# EAGLE schematic rgbsaber_control_v1.6 (EAGLE 5.10)
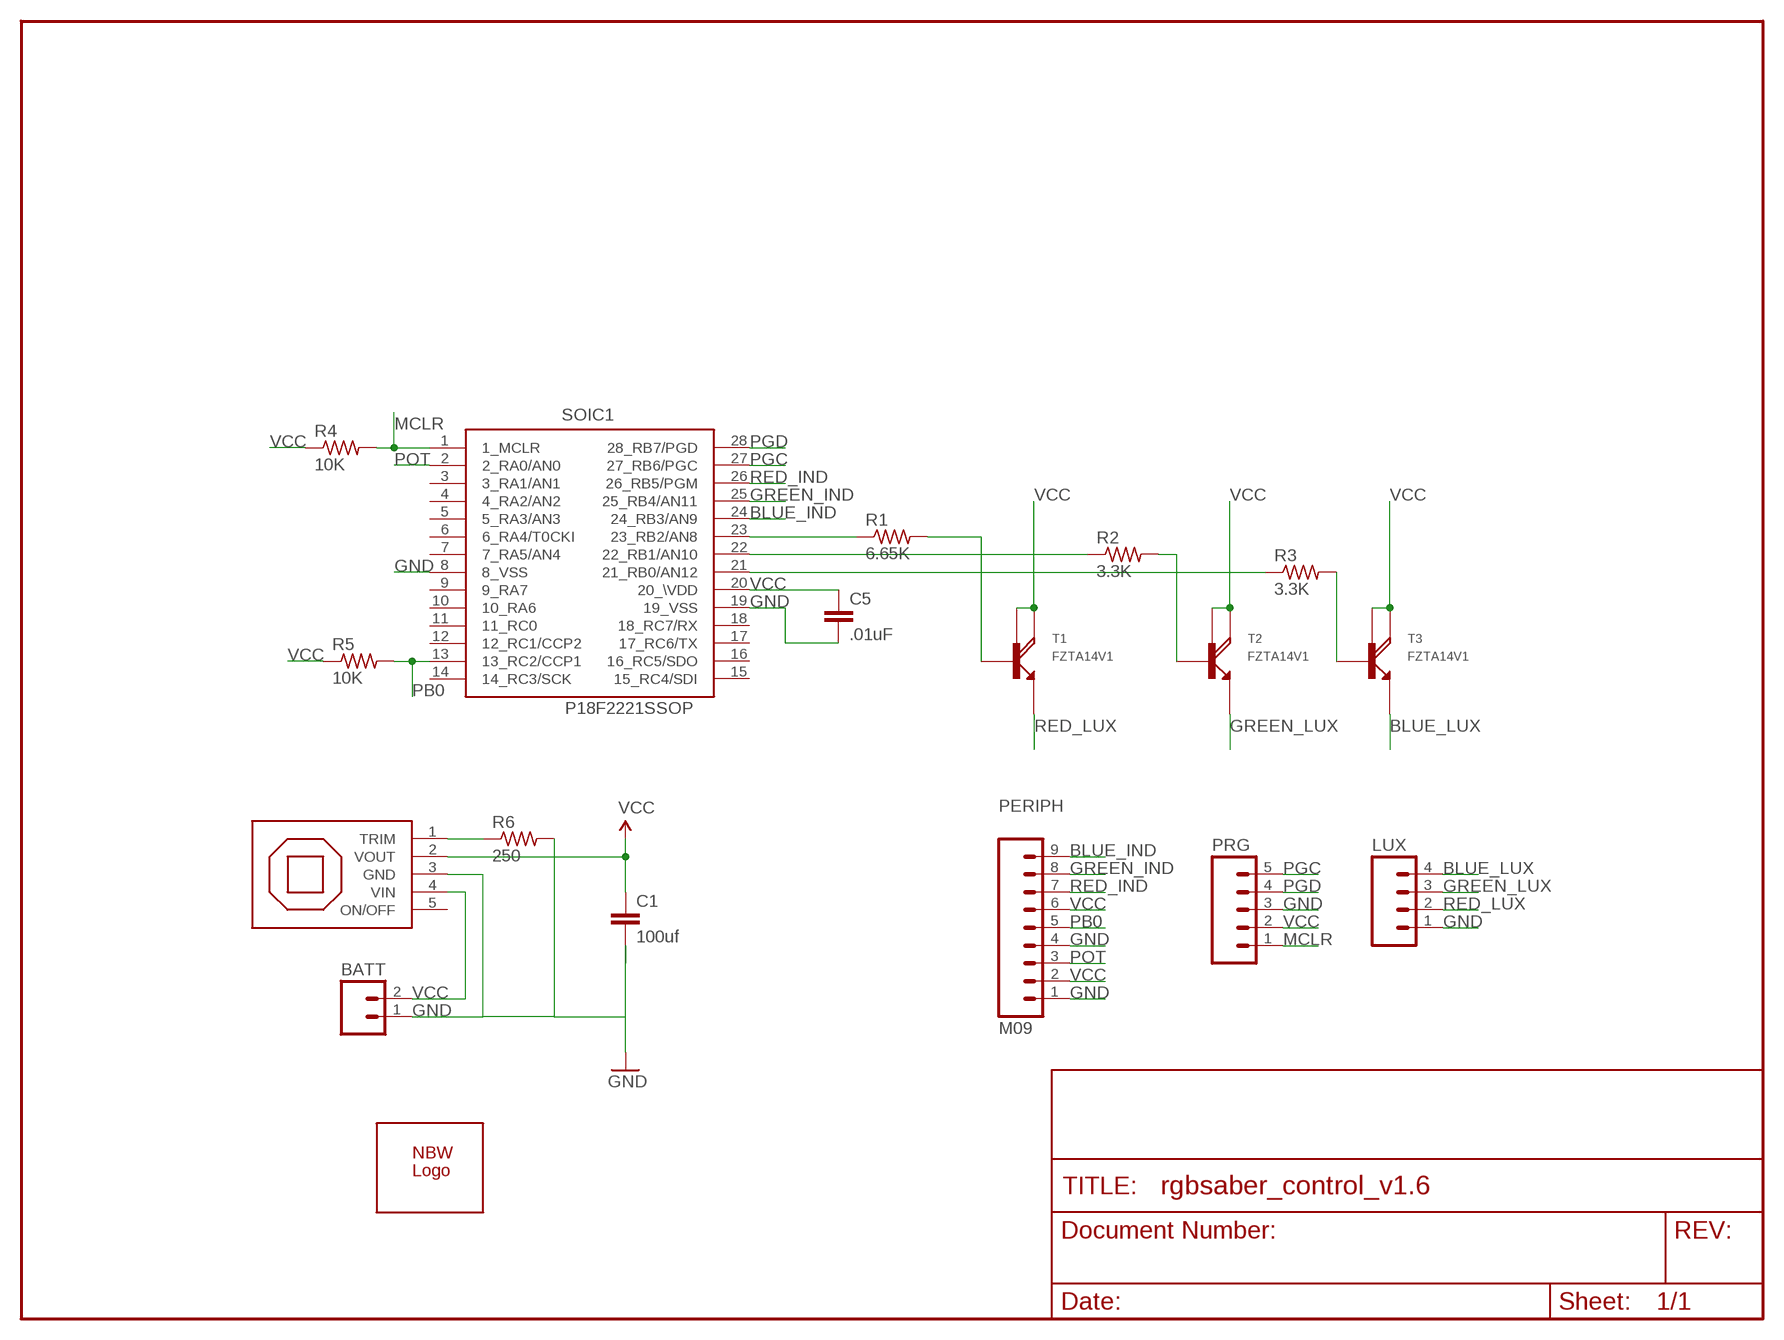
[diagram p0: schematic, sheet 1]

## Parts
BATT  M02PTH  [1X02]
C1  100uf  C5/7.2  [C5B7.2]
C5  .01uF  CAP0805  [0805]
LUX  M04PTH  [1X04]
PERIPH  M09  [1X09]
PRG  M05PTH  [1X05]
R1  6.65K  R-US_M0805  [M0805]
R2  3.3K  R-US_M0805  [M0805]
R3  3.3K  R-US_M0805  [M0805]
R4  10K  R-US_M0805  [M0805]
R5  10K  R-US_M0805  [M0805]
R6  250  R-US_M0805  [M0805]
REG  REG  OKR-T/3-W12  [1X05_2MM]
SOIC1  P18F2221SSOP  [SSOP-28]
T1  FZTA14V1  [SOT223]
T2  FZTA14V1  [SOT223]
T3  FZTA14V1  [SOT223]
U$5  NBW_LOGO  NBW_LOGOMED  [NBW_LOGO2]

## Nets
BLUE_IND: PERIPH.9 SOIC1.24(24_RB3/AN9)
BLUE_LUX: LUX.4 T3.EMIT(E)
GND: BATT.1 C1.2 C5.2 LUX.1 PERIPH.1 PERIPH.4 PRG.3 R6.2 REG.3(GND) SOIC1.8(8_VSS) SOIC1.19(19_VSS)
GREEN_IND: PERIPH.8 SOIC1.25(25_RB4/AN11)
GREEN_LUX: LUX.3 T2.EMIT(E)
MCLR: PRG.1 R4.2 SOIC1.1(1_MCLR)
N$1: R6.1 REG.1(TRIM)
N$4: R1.1 SOIC1.23(23_RB2/AN8)
N$5: R1.2 T1.BASE(B)
N$6: R2.1 SOIC1.22(22_RB1/AN10)
N$7: R2.2 T2.BASE(B)
N$8: R3.1 SOIC1.21(21_RB0/AN12)
N$9: R3.2 T3.BASE(B)
PB0: PERIPH.5 R5.2 SOIC1.13(13_RC2/CCP1)
PGC: PRG.5 SOIC1.27(27_RB6/PGC)
PGD: PRG.4 SOIC1.28(28_RB7/PGD)
POT: PERIPH.3 SOIC1.2(2_RA0/AN0)
PWR: BATT.2 REG.4(VIN)
RED_IND: PERIPH.7 SOIC1.26(26_RB5/PGM)
RED_LUX: LUX.2 T1.EMIT(E)
VCC: C1.1 C5.1 PERIPH.2 PERIPH.6 PRG.2 R4.1 R5.1 REG.2(VOUT) SOIC1.20(20_\VDD) T1.COLL(C) T1.HEAT(C2) T2.COLL(C) T2.HEAT(C2) T3.COLL(C) T3.HEAT(C2)
Unconnected: REG.5(ON/OFF) SOIC1.3(3_RA1/AN1) SOIC1.4(4_RA2/AN2) SOIC1.5(5_RA3/AN3) SOIC1.6(6_RA4/T0CKI) SOIC1.7(7_RA5/AN4) SOIC1.9(9_RA7) SOIC1.10(10_RA6) SOIC1.11(11_RC0) SOIC1.12(12_RC1/CCP2) SOIC1.14(14_RC3/SCK) SOIC1.15(15_RC4/SDI) SOIC1.16(16_RC5/SDO) SOIC1.17(17_RC6/TX) SOIC1.18(18_RC7/RX)

## Library data of the parts
BATT = SparkFun:M02: Header 2 Standard 2-pin 0.1" header. Use with straight break away headers (SKU : PRT-00116), right angle break away headers (PRT-00553), swiss pins (PRT-00743), machine pins (PRT-00117), and female headers (PRT-00115). Molex polarized connector foot print use with SKU : PRT-08233 with associated crimp pins and housings.
C1 = capacitor-wima:C: CAPACITOR naming: grid - package width
C5 = SparkFun:CAP: Capacitor Standard 0603 ceramic capacitor, and 0.1" leaded capacitor.
LUX = SparkFun:M04: Header 4 Standard 4-pin 0.1" header. Use with straight break away headers (SKU : PRT-00116), right angle break away headers (PRT-00553), swiss pins (PRT-00743), machine pins (PRT-00117), and female headers (PRT-00115). Molex polarized connector foot print use with SKU : PRT-08231 with associated crimp pins and housings.
PERIPH = SparkFun:M09: Header 9 Standard 9-pin 0.1" header. Use with straight break away headers (SKU : PRT-00116), right angle break away headers (PRT-00553), swiss pins (PRT-00743), machine pins (PRT-00117), and female headers (PRT-00115).
PRG = SparkFun:M05: Header 5 Standard 5-pin 0.1" header. Use with straight break away headers (SKU : PRT-00116), right angle break away headers (PRT-00553), swiss pins (PRT-00743), machine pins (PRT-00117), and female headers (PRT-00115). Molex polarized connector foot print use with SKU : PRT-08230 with associated crimp pins and housings.
R1-R6 = resistor:R-US_: RESISTOR, American symbol
REG = NBitWonder:OKR-T/3-W12
SOIC1 = purduecer:P18F2221: 28-pin PIC18F series Microcontroller
T1-T3 = purduecer:FZTA14: NPN Darlington Transistor
U$5 = NBitWonder:NBW_LOGO